# EAGLE design board (EAGLE 7.6.0)
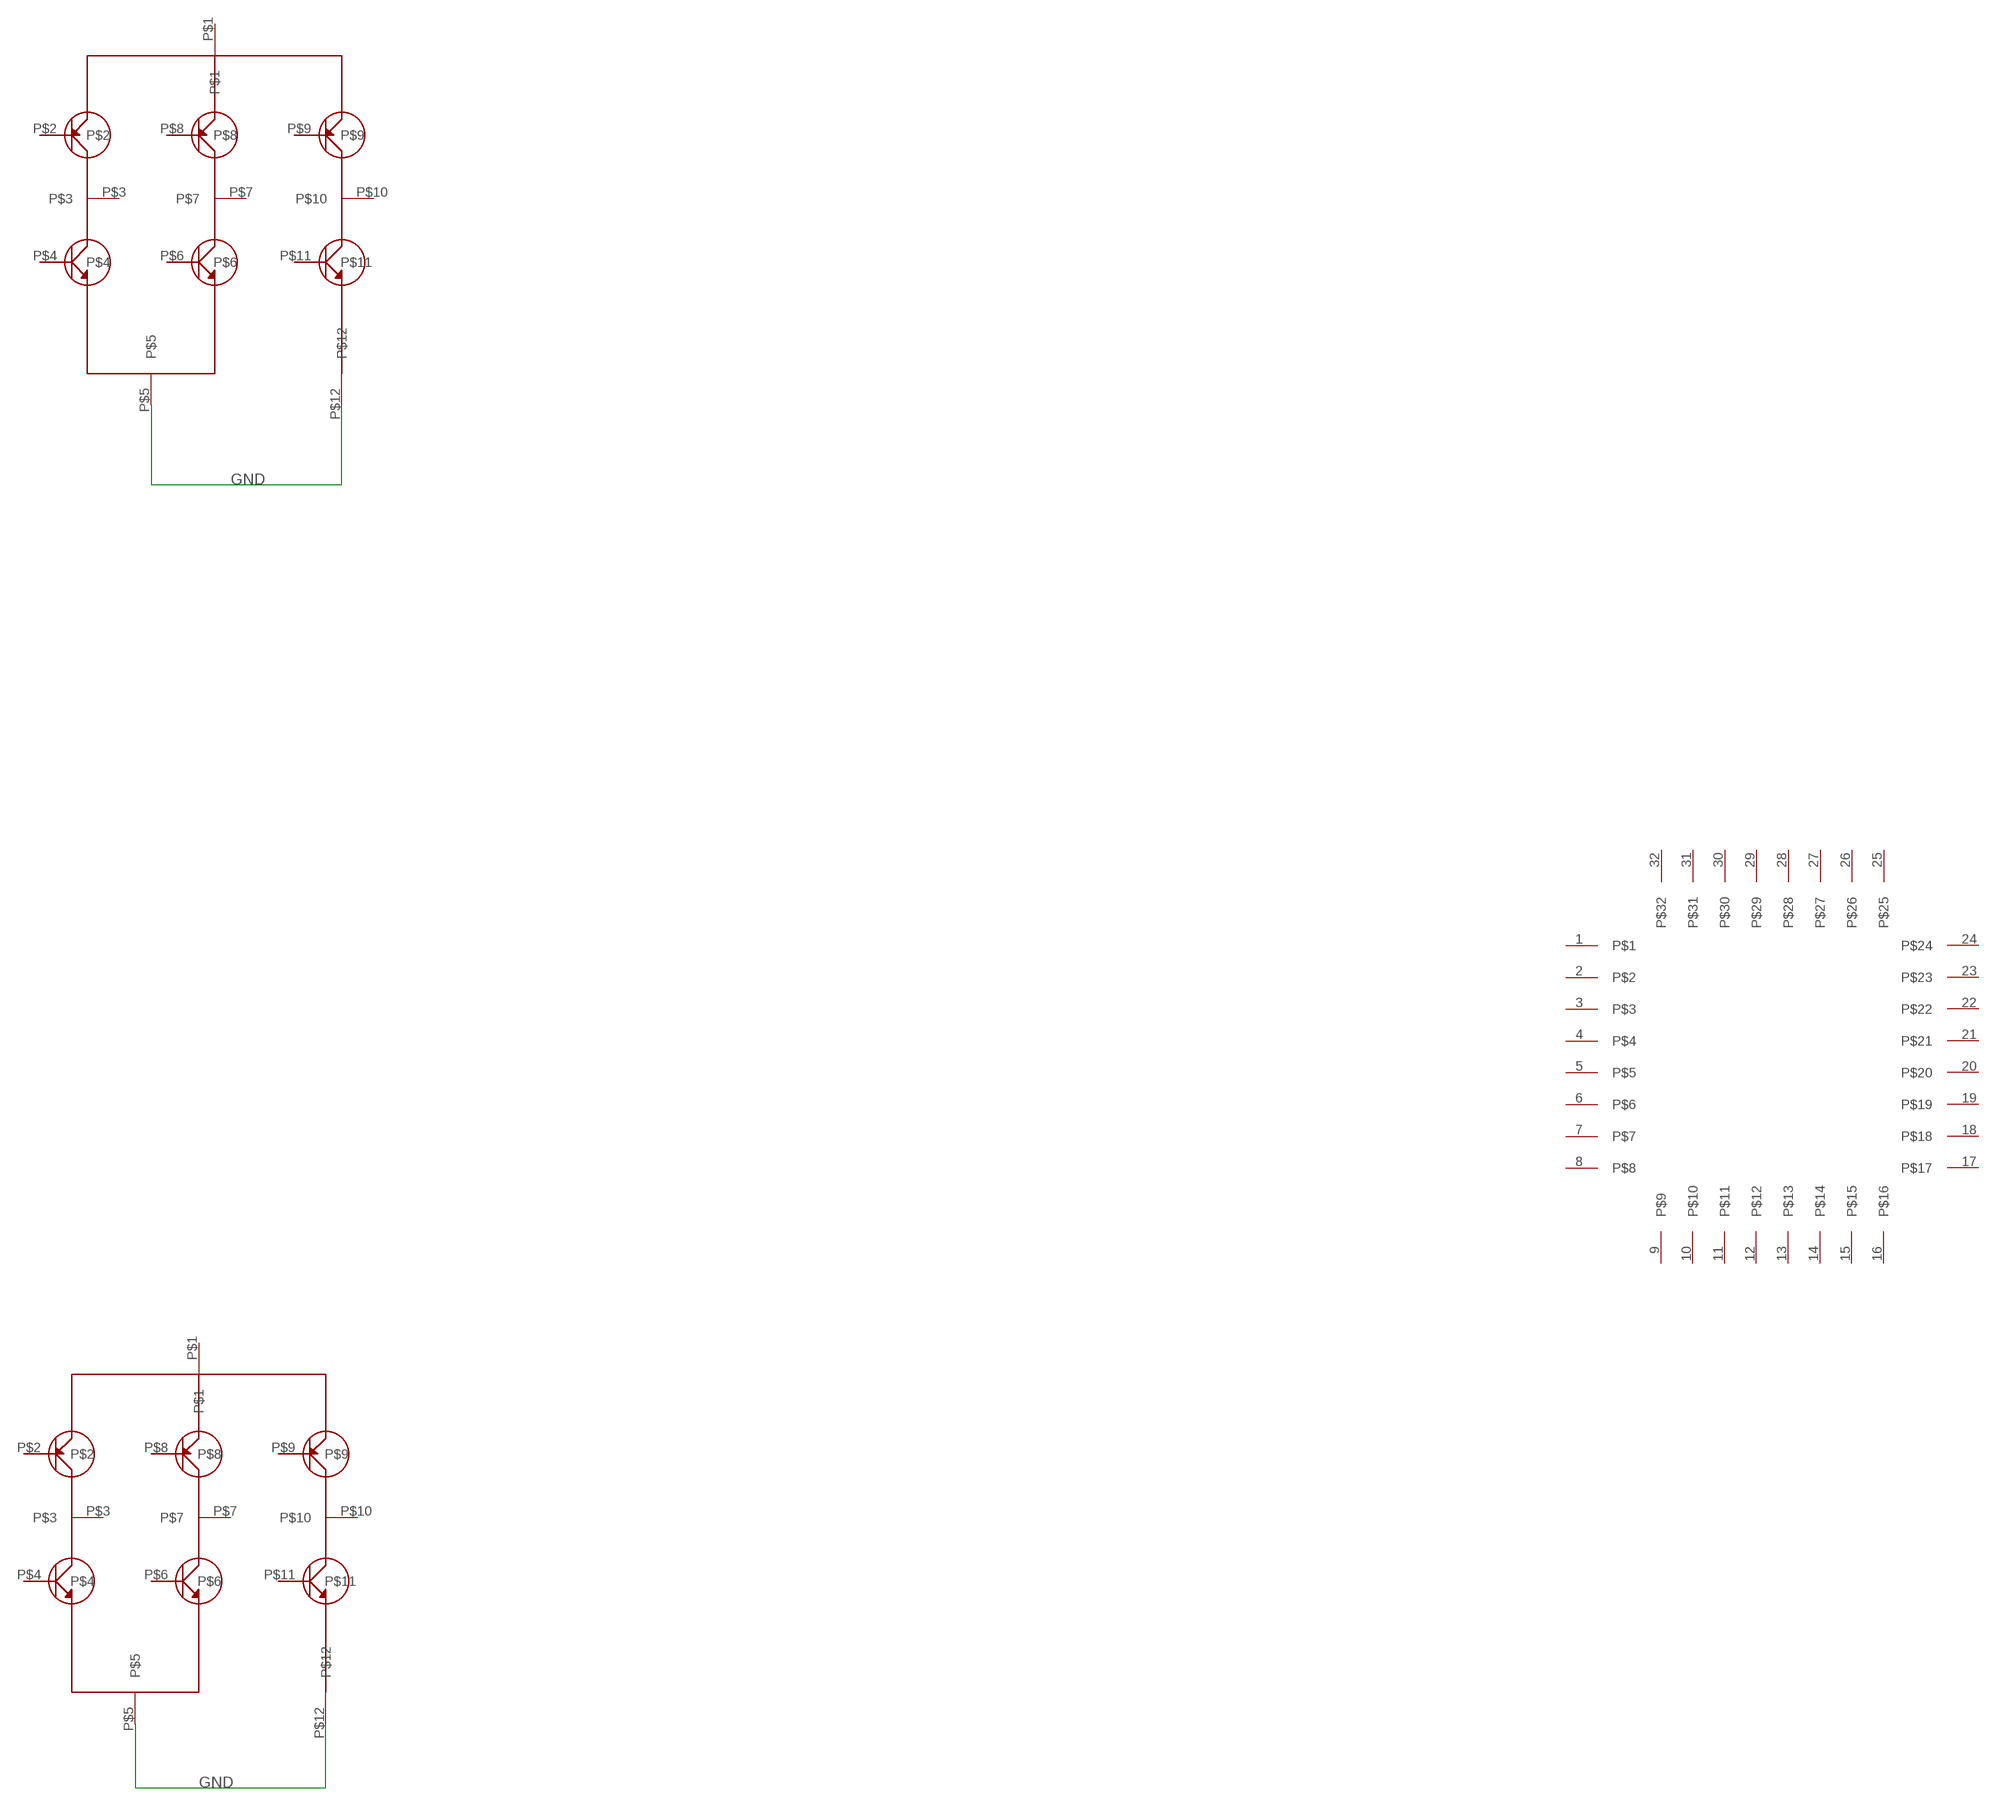
[diagram p0: schematic, sheet 1]

## Parts
U$1  EFM8SB  [QFP-32]
U$2  SMA6010  [SIP12(SMA12)]
U$3  SMA6010  [SIP12(SMA12)]

## Nets
GND: U$2.P$5 U$2.P$12 U$3.P$5 U$3.P$12
Unconnected: U$1.1 U$1.2 U$1.3 U$1.4 U$1.5 U$1.6 U$1.7 U$1.8 U$1.9 U$1.10 U$1.11 U$1.12 U$1.13 U$1.14 U$1.15 U$1.16 U$1.17 U$1.18 U$1.19 U$1.20 U$1.21 U$1.22 U$1.23 U$1.24 U$1.25 U$1.26 U$1.27 U$1.28 U$1.29 U$1.30 U$1.31 U$1.32 U$2.P$1 U$2.P$2 U$2.P$3 U$2.P$4 U$2.P$6 U$2.P$7 U$2.P$8 U$2.P$9 U$2.P$10 U$2.P$11 U$3.P$1 U$3.P$2 U$3.P$3 U$3.P$4 U$3.P$6 U$3.P$7 U$3.P$8 U$3.P$9 U$3.P$10 U$3.P$11

## Library data of the parts
U$1 = mcu:EFM8SB
U$2 U$3 = transistors:SMA6010

## Board
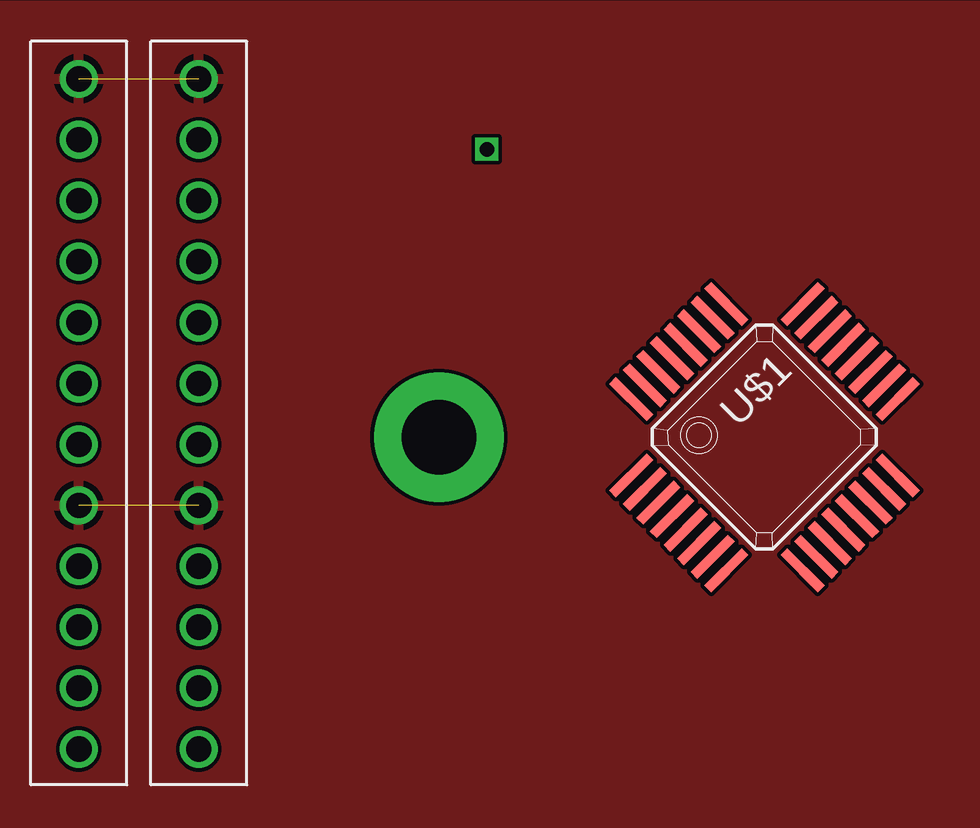
[diagram p1: board, top side]

No outline drawn. Coordinates in mm, seen from the top.
Copper layers (1*16): Top 0.0356mm / dielectric 1.5011mm / Bottom 0.0356mm
Design rules "oshpark-2layer": minimum track width 6mil, minimum drill 13mil, track to track 6mil, track to pad 6mil, pad to pad 6mil, via to via 6mil, smd to smd 6mil, copper to edge 15mil, drill to drill 6mil, minimum pad ring 7mil, minimum via ring 7mil, stop-mask expansion 2.5mil, vias tented up to drill 0mil, thermal gap 10mil

### Footprints (pad centres in the part's own frame; a part is rotated, then mirrored left to right if it is on the bottom)
QFP-32 = smd 0.4 x 2.2: 1 -2.4,-4.65; 2 -1.6,-4.65; 3 -0.8,-4.65; 4 0,-4.65; 5 0.8,-4.65; 6 1.6,-4.65; 7 2.4,-4.65; 8 3.2,-4.65; 17 3.2,5.45; 18 2.4,5.45; 19 1.6,5.45; 20 0.8,5.45; 21 0,5.45; 22 -0.8,5.45; 23 -1.6,5.45; 24 -2.4,5.45 | smd 2.2 x 0.4: 9 5.45,-2.4; 10 5.45,-1.6; 11 5.45,-0.8; 12 5.45,0; 13 5.45,0.8; 14 5.45,1.6; 15 5.45,2.4; 16 5.45,3.2; 25 -4.65,3.2; 26 -4.65,2.4; 27 -4.65,1.6; 28 -4.65,0.8; 29 -4.65,0; 30 -4.65,-0.8; 31 -4.65,-1.6; 32 -4.65,-2.4
SIP12(SMA12) = drill 1.05: P$1 0,0; P$2 2.54,0; P$3 5.08,0; P$4 7.62,0; P$5 10.16,0; P$6 12.7,0; P$7 15.24,0; P$8 17.78,0; P$9 20.32,0; P$10 22.86,0; P$11 25.4,0; P$12 27.94,0

### Placement (x,y rotation side)
U$1  41,22 315 top
U$2  18,9 90 top
U$3  13,9 90 top

### Tracks (layer width: path | path; a pad name or v marks a point on that pad's centre or on a via)
GND  (2 unrouted)
  pour Top: 7,40 56,40 56,5 7,5
N$1  (via drill 3.1 pad 5.4)
  other vias: 28,22
N$2  (via drill 0.6)
  other vias: 30,34